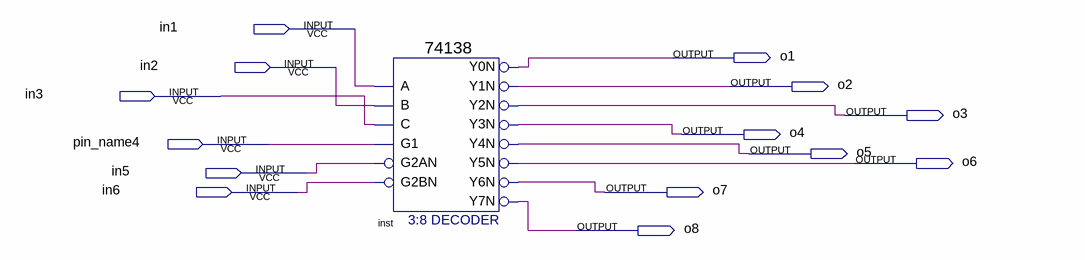
[diagram p0: schematic sheet]
// Quartus schematic hgh.bdf as structural Verilog: 1 symbols, 14 pins
module hgh (
  input  in1,
  input  in2,
  input  in3,
  input  pin_name4,
  input  in5,
  input  in6,
  output o1,
  output o2,
  output o3,
  output o4,
  output o5,
  output o6,
  output o7,
  output o8
);

  \74138  inst (
    .A(in1), .B(in2), .G1(pin_name4), .C(in3), .G2AN(in5), .G2BN(in6), .Y0N(o1), .Y1N(o2), .Y2N(o3),
    .Y3N(o4), .Y4N(o5), .Y5N(o6), .Y6N(o7), .Y7N(o8));
endmodule
